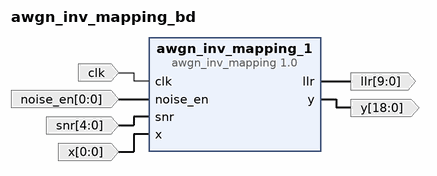
[diagram p0: block diagram of the top level]
# Vivado block design awgn_inv_mapping_bd, xc7z020clg484-1, Vivado 2018.3
create_bd_design awgn_inv_mapping_bd

create_bd_port -dir I -type clk clk
create_bd_port -dir O -from 9 -to 0 -type data llr
create_bd_port -dir I -from 0 -to 0 -type data noise_en
create_bd_port -dir I -from 4 -to 0 -type data snr
create_bd_port -dir I -from 0 -to 0 -type data x
create_bd_port -dir O -from 18 -to 0 -type data y

create_bd_cell -type ip -vlnv User_Company:SysGen:awgn_inv_mapping:1.0 awgn_inv_mapping_1

# ---- connections ----

connect_bd_net [get_bd_ports clk] [get_bd_pins awgn_inv_mapping_1/clk]
connect_bd_net [get_bd_pins awgn_inv_mapping_1/llr] [get_bd_ports llr]
connect_bd_net [get_bd_ports noise_en] [get_bd_pins awgn_inv_mapping_1/noise_en]
connect_bd_net [get_bd_ports snr] [get_bd_pins awgn_inv_mapping_1/snr]
connect_bd_net [get_bd_ports x] [get_bd_pins awgn_inv_mapping_1/x]
connect_bd_net [get_bd_pins awgn_inv_mapping_1/y] [get_bd_ports y]

validate_bd_design
save_bd_design
